# EAGLE design xkid_sensor_0.1 (EAGLE 7.1.0)
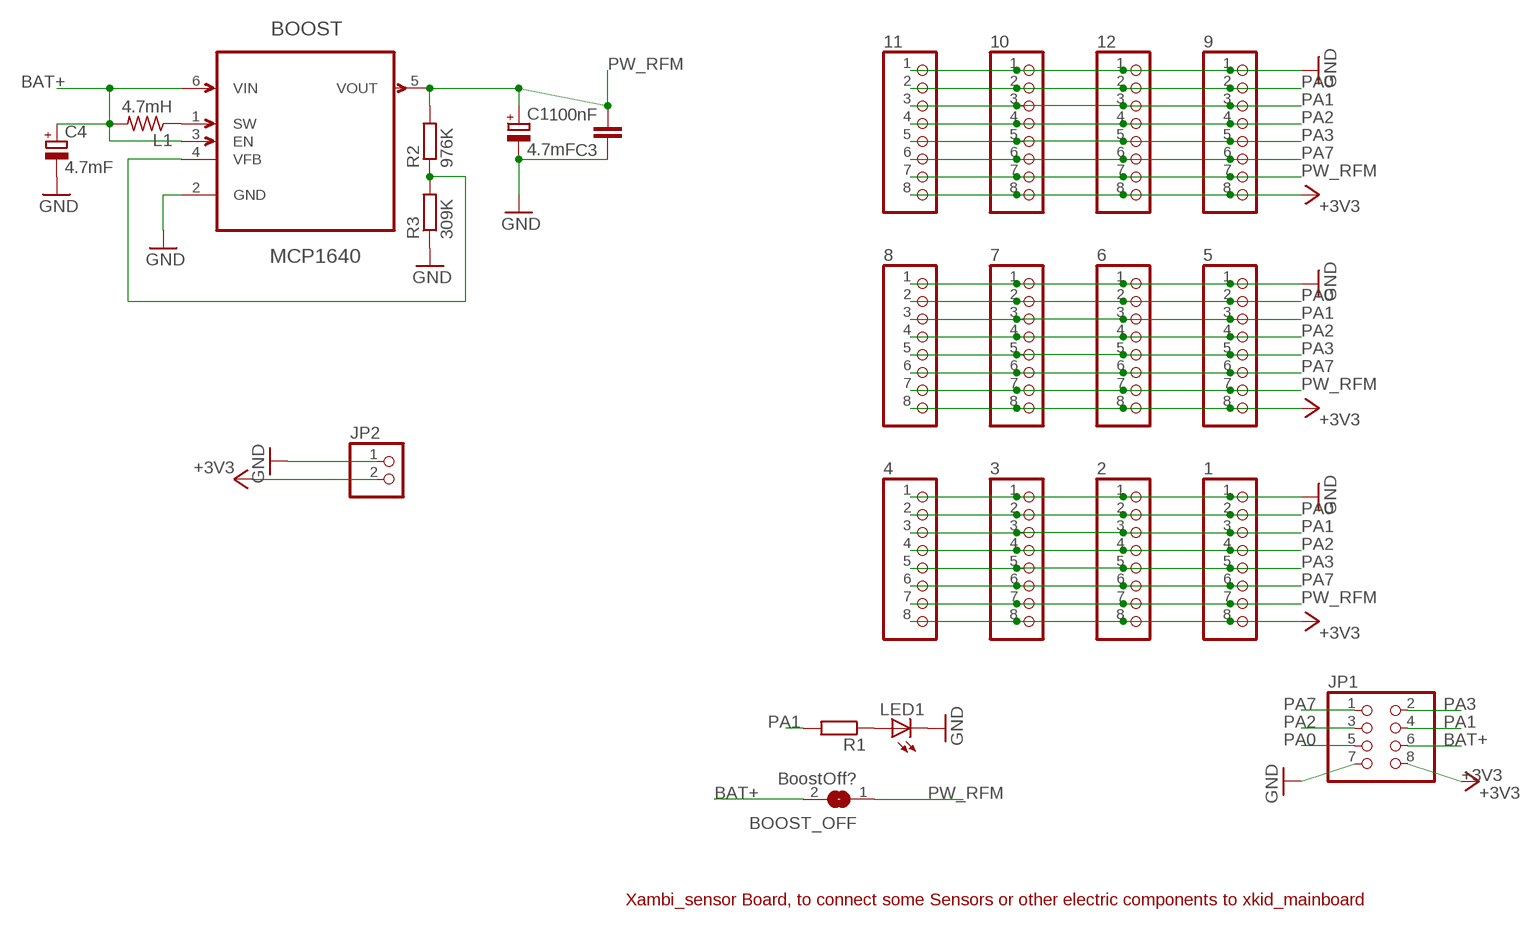
[diagram p0: schematic, sheet 1]

## Parts
1  PINHD-1X8_2.00  [1X08M]
2  PINHD-1X8_2.00  [1X08M]
3  PINHD-1X8_2.00  [1X08M]
4  PINHD-1X8_2.00  [1X08M]
5  PINHD-1X8_2.00  [1X08M]
6  PINHD-1X8_2.00  [1X08M]
7  PINHD-1X8_2.00  [1X08M]
8  PINHD-1X8_2.00  [1X08M]
9  PINHD-1X8_2.00  [1X08M]
10  PINHD-1X8_2.00  [1X08M]
11  PINHD-1X8_2.00  [1X08M]
12  PINHD-1X8_2.00  [1X08M]
BOOST  MCP1640  MCP1640BT-I/CHY  [SOT95P270X145-6N]
BOOST_OFF  BoostOff?  SJ  [SJ]
C1  4.7mF  CPOL-EUCT3216  [CT3216]
C3  100nF  C-EUC0805K  [C0805K]
C4  4.7mF  CPOL-EUCT3216  [CT3216]
JP1  PINHD-2X4_2.54  [2X04]
JP2  PINHD-1X2  [1X02]
L1  4.7mH  R-US_0204/5  [0204/5]
LED1  LEDCHIPLED_0805  [CHIPLED_0805]
R1  R-EU_R0805  [R0805]
R2  976K  R-EU_R0805  [R0805]
R3  309K  R-EU_R0805  [R0805]

## Nets
+3V3: 1.8 2.8 3.8 4.8 5.8 6.8 7.8 8.8 9.8 10.8 11.8 12.8 JP1.8 JP2.2
BAT+: BOOST.3(EN) BOOST.6(VIN) BOOST_OFF.2 C4.+ JP1.6 L1.2
GND: 1.1 2.1 3.1 4.1 5.1 6.1 7.1 8.1 9.1 10.1 11.1 12.1 BOOST.2(GND) C1.- C3.1 C4.- JP1.7 JP2.1 LED1.C R3.1
N$1: LED1.A R1.1
N$2: BOOST.1(SW) L1.1
N$4: BOOST.4(VFB) R2.1 R3.2
PA0: 1.2 2.2 3.2 4.2 5.2 6.2 7.2 8.2 9.2 10.2 11.2 12.2 JP1.5
PA1: 1.3 2.3 3.3 4.3 5.3 6.3 7.3 8.3 9.3 10.3 11.3 12.3 JP1.4 R1.2
PA2: 1.4 2.4 3.4 4.4 5.4 6.4 7.4 8.4 9.4 10.4 11.4 12.4 JP1.3
PA3: 1.5 2.5 3.5 4.5 5.5 6.5 7.5 8.5 9.5 10.5 11.5 12.5 JP1.2
PA7: 1.6 2.6 3.6 4.6 5.6 6.6 7.6 8.6 9.6 10.6 11.6 12.6 JP1.1
PW_RFM: 1.7 2.7 3.7 4.7 5.7 6.7 7.7 8.7 9.7 10.7 11.7 12.7 BOOST.5(VOUT) BOOST_OFF.1 C1.+ C3.2 R2.2

## Notes on the sheet
- Xambi_sensor Board, to connect some Sensors or other electric components to xkid_mainboard

## Library data of the parts
1-12 = pinhead:PINHD-1X8: PIN HEADER
BOOST = xpix:MCP1640BT-I/CHY: Synchronous Boost Regulator; MPN: MCP1640BT-I/CHY; OC_FARNELL: 1800207; OC_NEWARK: 73R3625; PACKAGE: SOT-6; SUPPLIER: Microchip
BOOST_OFF = jumper:SJ: SMD solder JUMPER
C1 C4 = rcl:CPOL-EU: POLARIZED CAPACITOR, European symbol
C3 = rcl:C-EU: CAPACITOR, European symbol
JP1 = pinhead:PINHD-2X4: PIN HEADER
JP2 = pinhead:PINHD-1X2: PIN HEADER
L1 = _adafruit:R-US_: RESISTOR, American symbol
LED1 = _adafruit:LED: LED OSRAM: - CHIPLED LG R971, LG N971, LY N971, LG Q971, LY Q971, LO R971, LY R971 LH N974, LH R974 LS Q976, LO Q976, LY Q976 LO Q996 - Hyper CHIPLED LW Q18S LB Q993, LB Q99A, LB R99A - SideLED LS A670, LO A670, LY A670, LG A670, LP A670 LB A673, LV A673, LT A673, LW A673 LH A674 LY A675 LS A676, LA A676, LO A676, LY A676, LW A676 LS A679, LY A679, LG A679 - Hyper Micro SIDELED® LS Y876, LA Y876, LO Y876, LY Y876 LT Y87S - SmartLED LW L88C, LW L88S LB L89C, LB L89S, LG L890 LS L89K, LO L89K, LY L89K LS L896, LA L896, LO L896, LY L896 - TOPLED LS T670, LO T670, LY T670, LG T670, LP T670 LSG T670, LSP T670, LSY T670, LOP T670, LYG T670 LG T671, LOG T671, LSG T671 LB T673, LV T673, LT T673, LW T673 LH T674 LS T676, LA T676, LO T676, LY T676, LB T676, LH T676, LSB T676, LW T676 LB T67C, LV T67C, LT T67C, LS T67K, LO T67K, LY T67K, LW E67C LS E67B, LA E67B, LO E67B, LY E67B, LB E67C, LV E67C, LT E67C LW T67C LS T679, LY T679, LG T679 LS T770, LO T770, LY T770, LG T770, LP T770 LB T773, LV T773, LT T773, LW T773 LH T774 LS E675, LA E675, LY E675, LS T675 LS T776, LA T776, LO T776, LY T776, LB T776 LHGB T686 LT T68C, LB T68C - Hyper Mini TOPLED® LB M676 - Mini TOPLED Santana® LG M470 LS M47K, LO M47K, LY M47K Source: http://www.osram.convergy.de/
R1-R3 = rcl:R-EU_: RESISTOR, European symbol

## Board
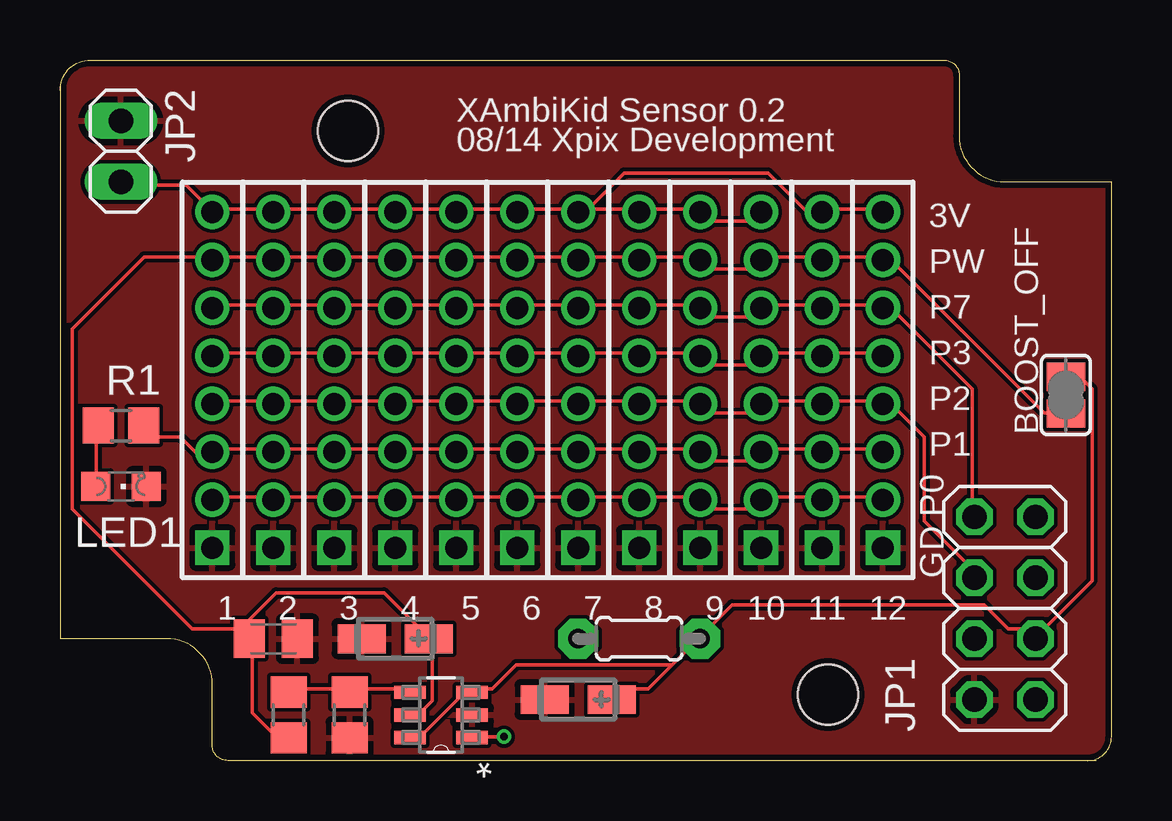
[diagram p1: board, top side]
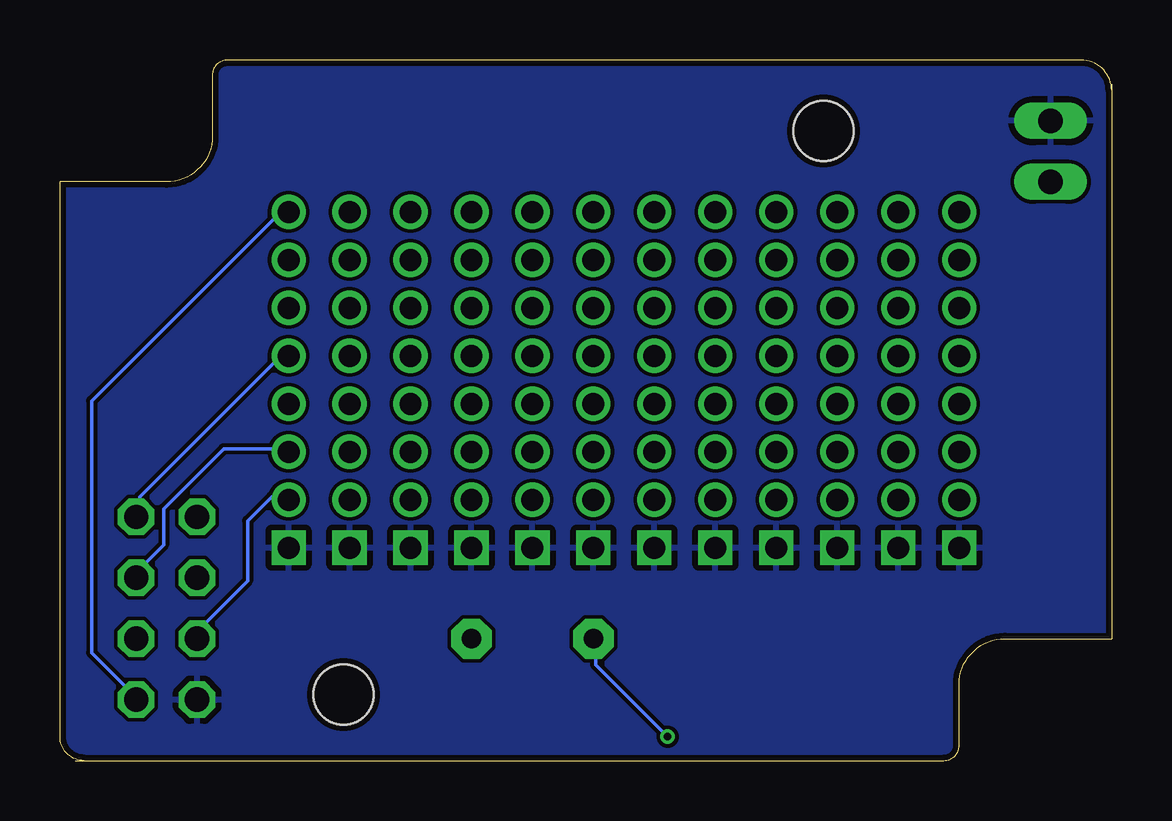
[diagram p2: board, bottom side, seen from below]

Size 43.81 x 29.21 mm. Coordinates in mm from the lower left corner, seen from the top.
Outline: 42.81,0 arc90 43.81,1 43.81,24.13 39.37,24.13 arc-90 37.47,26.04 37.47,28.57 arc90 36.83,29.21 1.27,29.21 arc90 0,27.94
Outline: 0,28.21 0,5.08 4.45,5.08 arc-90 6.35,3.17 6.35,0.64 arc90 6.99,0 43.18,0
Copper layers (1*16): Top 0.035mm / dielectric 1.5mm / Bottom 0.035mm
Design rules "ITEADstudio_DRC": minimum track width 6mil, minimum drill 12mil, track to track 6mil, track to pad 6mil, pad to pad 6mil, via to via 6mil, smd to smd 0mil, copper to edge 10mil, drill to drill 10mil, minimum pad ring 10mil, minimum via ring 6mil, stop-mask expansion 2mil, vias tented up to drill 100mil, thermal gap 10mil
Holes 2.5 mm at 32,2.75 12,26.25

### Footprints (pad centres in the part's own frame; a part is rotated, then mirrored left to right if it is on the bottom)
1X08M = drill 0.914 square: 1 -7,0 | drill 0.914: 2 -5,0; 3 -3,0; 4 -1,0; 5 1,0; 6 3,0; 7 5,0; 8 7,0
SOT95P270X145-6N = smd 1.321 x 0.559: 1 -1.295,0.94; 2 -1.295,0; 3 -1.295,-0.94; 4 1.295,-0.94; 5 1.295,0; 6 1.295,0.94
SJ = smd 1.168 x 1.6: 1 -0.762,0; 2 0.762,0
CT3216 = smd 2 x 1.2: + -1.4,0; - 1.4,0
C0805K = smd 1.3 x 1.6: 1 -1,0; 2 1,0
2X04 = drill 1.016 octagon: 1 -3.81,-1.27; 2 -3.81,1.27; 3 -1.27,-1.27; 4 -1.27,1.27; 5 1.27,-1.27; 6 1.27,1.27; 7 3.81,-1.27; 8 3.81,1.27
1X02 = drill 1.016 long: 1 -1.27,0; 2 1.27,0
0204/5 = drill 0.813 pad 1.676 octagon: 1 -2.54,0; 2 2.54,0
CHIPLED_0805 = smd 1.2 x 1.2: A 0,-1.05; C 0,1.05
R0805 = smd 1.3 x 1.5: 1 -0.95,0; 2 0.95,0

### Placement (x,y rotation side)
1  6.35,15.88 90 top
2  8.89,15.88 90 top
3  11.43,15.88 90 top
4  13.97,15.88 90 top
5  16.51,15.88 90 top
6  19.05,15.88 90 top
7  21.59,15.88 90 top
8  24.13,15.88 90 top
9  26.67,15.88 90 top
10  29.21,15.88 90 top
11  31.75,15.88 90 top
12  34.29,15.88 90 top
BOOST  15.88,1.91 180 top
BOOST_OFF  41.91,15.24 90 top
C1  13.97,5.08 180 top
C3  8.89,5.08 180 top
C4  21.59,2.54 180 top
JP1  39.37,6.35 270 top
JP2  2.54,25.4 270 top
L1  24.13,5.08 0 top
LED1  2.54,11.43 270 top
R1  2.54,13.97 0 top
R2  9.53,1.91 270 top
R3  12.06,1.91 90 top

### Tracks (layer width: path | path; a pad name or v marks a point on that pad's centre or on a via)
+3V3
  Top 0.152: 10.8 29,22.5 27,22.5 9.8 26.5,23 24.5,23 8.8 24,23 22,23 | 12.8 34,23 32,23 11.8 31.5,22.5 29.5,24.5 23.5,24.5 22,23 | 22,23 7.8 21.5,23 19.5,23 6.8 19,23 17,23 5.8 16.5,23 14,23 4.8 13.5,23 11.5,23 3.8 11,23 9,23 2.8 8.5,23 6.5,23 1.8 6.25,23 5.25,24 2.75,24 JP2.2
  Bottom 0.152: JP1.8 41,3 42.5,4.5 42.5,15 34.5,23 12.8
BAT+
  Top 0.152: BOOST_OFF.2 42,16 42.5,16 43,15.5 43,7.5 41,5.5 JP1.6 40.5,5.5 39.5,5.5 38.5,6.5 28,6.5 27,5.5 L1.2 26.5,5 25.5,4 | BOOST.6 15,1 17,3 BOOST.3 17.5,3 18,3 19,4 25.5,4 | 25.5,4 24.5,3 23,3 C4.+
GND
  pour Bottom: 0,0 0,29.21 44.45,29.21 44.45,0
  pour Top: 0,0 0,29.21 44.45,29.21 44.45,0
N$1
  Top 0.152: LED1.A 1.5,11.5 1.5,13.5 R1.1
N$2  (via drill 0.3)
  Top 0.152: v18.5,1 17.5,1 BOOST.1
  Bottom 0.152: v18.5,1 21.5,4 21.5,5 L1.1
N$4
  Top 0.152: BOOST.4 14.5,3 12.5,3 R3.2 12,3 10,3 R2.1
PA0
  Top 0.152: 12.2 34,11 32,11 11.2 31.5,11 29.5,11 10.2 29,10.5 27,10.5 9.2 26.5,11 24.5,11 8.2 24,11 22,11 7.2 21.5,11 19.5,11 6.2 19,11 17,11 5.2 16.5,11 14,11 4.2 13.5,11 11.5,11 3.2 11,11 9,11 2.2 8.5,11 6.5,11 1.2
  Bottom 0.152: JP1.5 38,5.5 36,7.5 36,10 35,11 34.5,11 12.2
PA1
  Top 0.152: 12.3 34,13 32,13 11.3 31.5,13 29.5,13 10.3 29,12.5 27,12.5 9.3 26.5,13 24.5,13 8.3 24,13 22,13 7.3 21.5,13 19.5,13 6.3 19,13 17,13 5.3 16.5,13 14,13 4.3 13.5,13 11.5,13 3.3 11,13 9,13 2.3 8.5,13 6.5,13 1.3 6,12.5 5,13.5 3.5,13.5 R1.2
  Bottom 0.152: JP1.4 40.5,8 39.5,9 39.5,10.5 37,13 34.5,13 12.3
PA2
  Top 0.152: JP1.3 38,8 36,10 36,13.5 34.5,15 12.4 34,15 32,15 11.4 31.5,15 29.5,15 10.4 29,14.5 27,14.5 9.4 26.5,15 24.5,15 8.4 24,15 22,15 7.4 21.5,15 19.5,15 6.4 19,15 17,15 5.4 16.5,15 14,15 4.4 13.5,15 11.5,15 3.4 11,15 9,15 2.4 8.5,15 6.5,15 1.4
PA3
  Top 0.152: 12.5 34,17 32,17 11.5 31.5,17 29.5,17 10.5 29,16.5 27,16.5 9.5 26.5,17 24.5,17 8.5 24,17 22,17 7.5 21.5,17 19.5,17 6.5 19,17 17,17 5.5 16.5,17 14,17 4.5 13.5,17 11.5,17 3.5 11,17 9,17 2.5 8.5,17 6.5,17 1.5
  Bottom 0.152: JP1.2 40.5,10.5 40.5,11 34.5,17 12.5
PA7
  Top 0.152: JP1.1 38,10.5 38,15.5 34.5,19 12.6 34,19 32,19 11.6 31.5,19 29.5,19 10.6 29,18.5 27,18.5 9.6 26.5,19 24.5,19 8.6 24,19 22,19 7.6 21.5,19 19.5,19 6.6 19,19 17,19 5.6 16.5,19 14,19 4.6 13.5,19 11.5,19 3.6 11,19 9,19 2.6 8.5,19 6.5,19 1.6
PW_RFM
  Top 0.152: BOOST_OFF.1 41.5,14.5 41,14.5 34.5,21 12.7 34,21 32,21 11.7 31.5,21 29.5,21 10.7 29,20.5 27,20.5 9.7 26.5,21 24.5,21 8.7 24,21 22,21 7.7 21.5,21 19.5,21 6.7 19,21 17,21 5.7 16.5,21 14,21 4.7 13.5,21 11.5,21 3.7 11,21 9,21 2.7 8.5,21 6.5,21 1.7 6,21 3.5,21 0.5,18 0.5,10.5 5.5,5.5 7.5,5.5 | BOOST.5 15,2 15.5,2.5 15.5,5 C1.+ 15,5.5 13.5,7 9,7 7.5,5.5 | R2.2 9.5,1 9,1 8,2 8,5 C3.2 7.5,5.5

### Text on the board
tNames: XAmbiKid Sensor 0.2 / 08/14 Xpix Development | 3V | PW | P7 | P3 | P2 | P1 | P0 | GD